# EAGLE schematic rhoby_motor(L6205) (EAGLE 8.3.0)
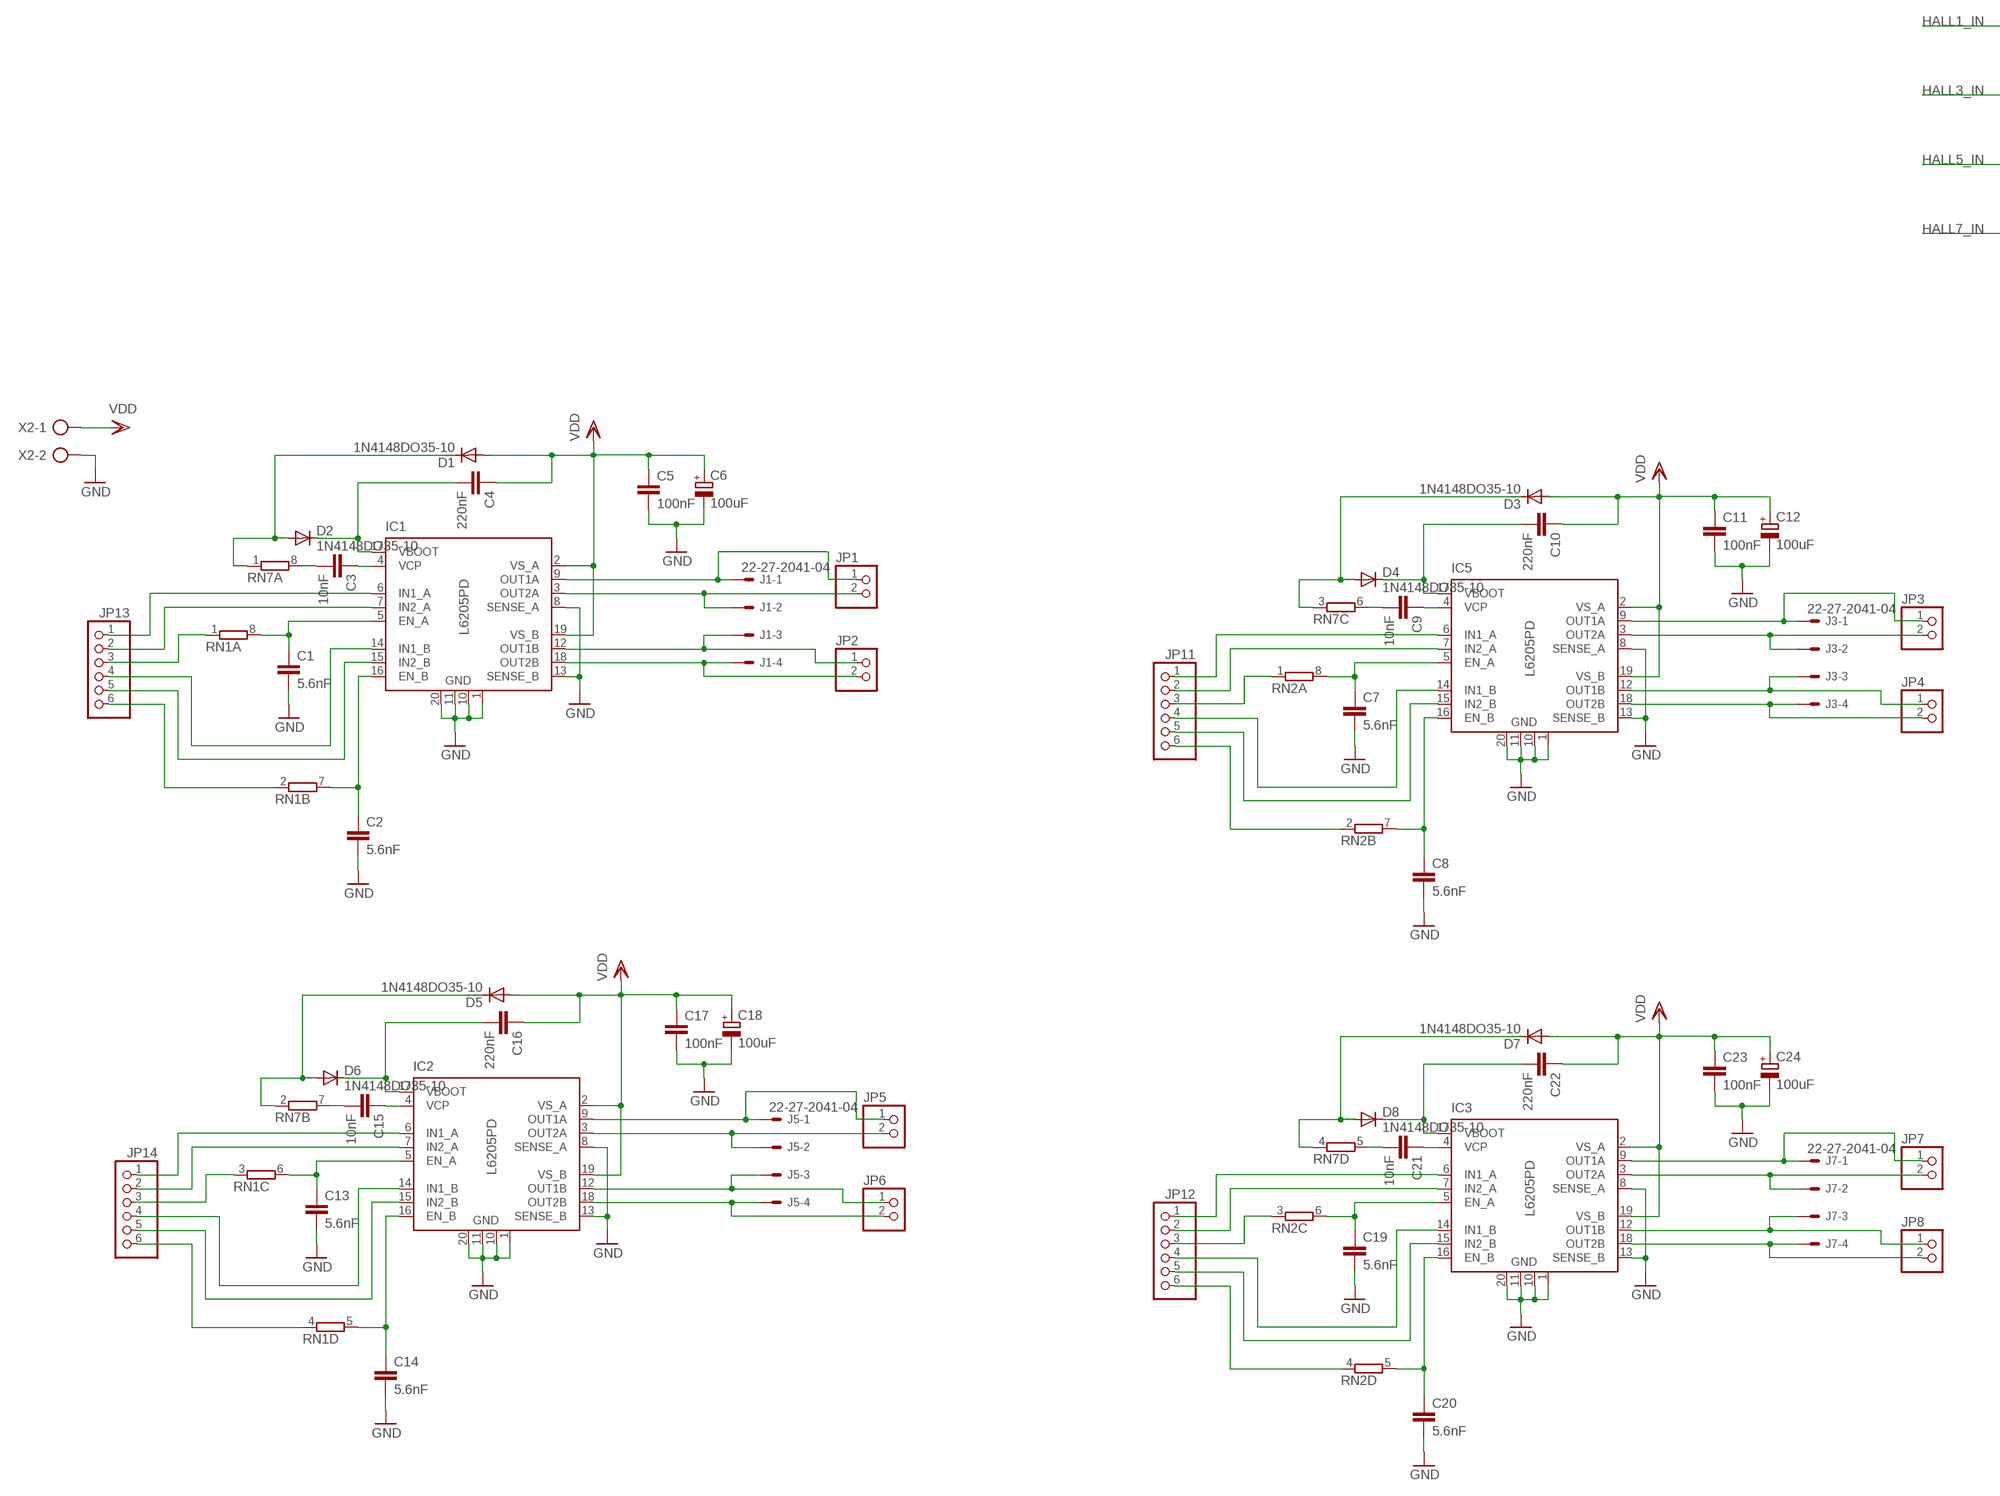
[diagram p0: schematic, sheet 1, part 1 of 2]
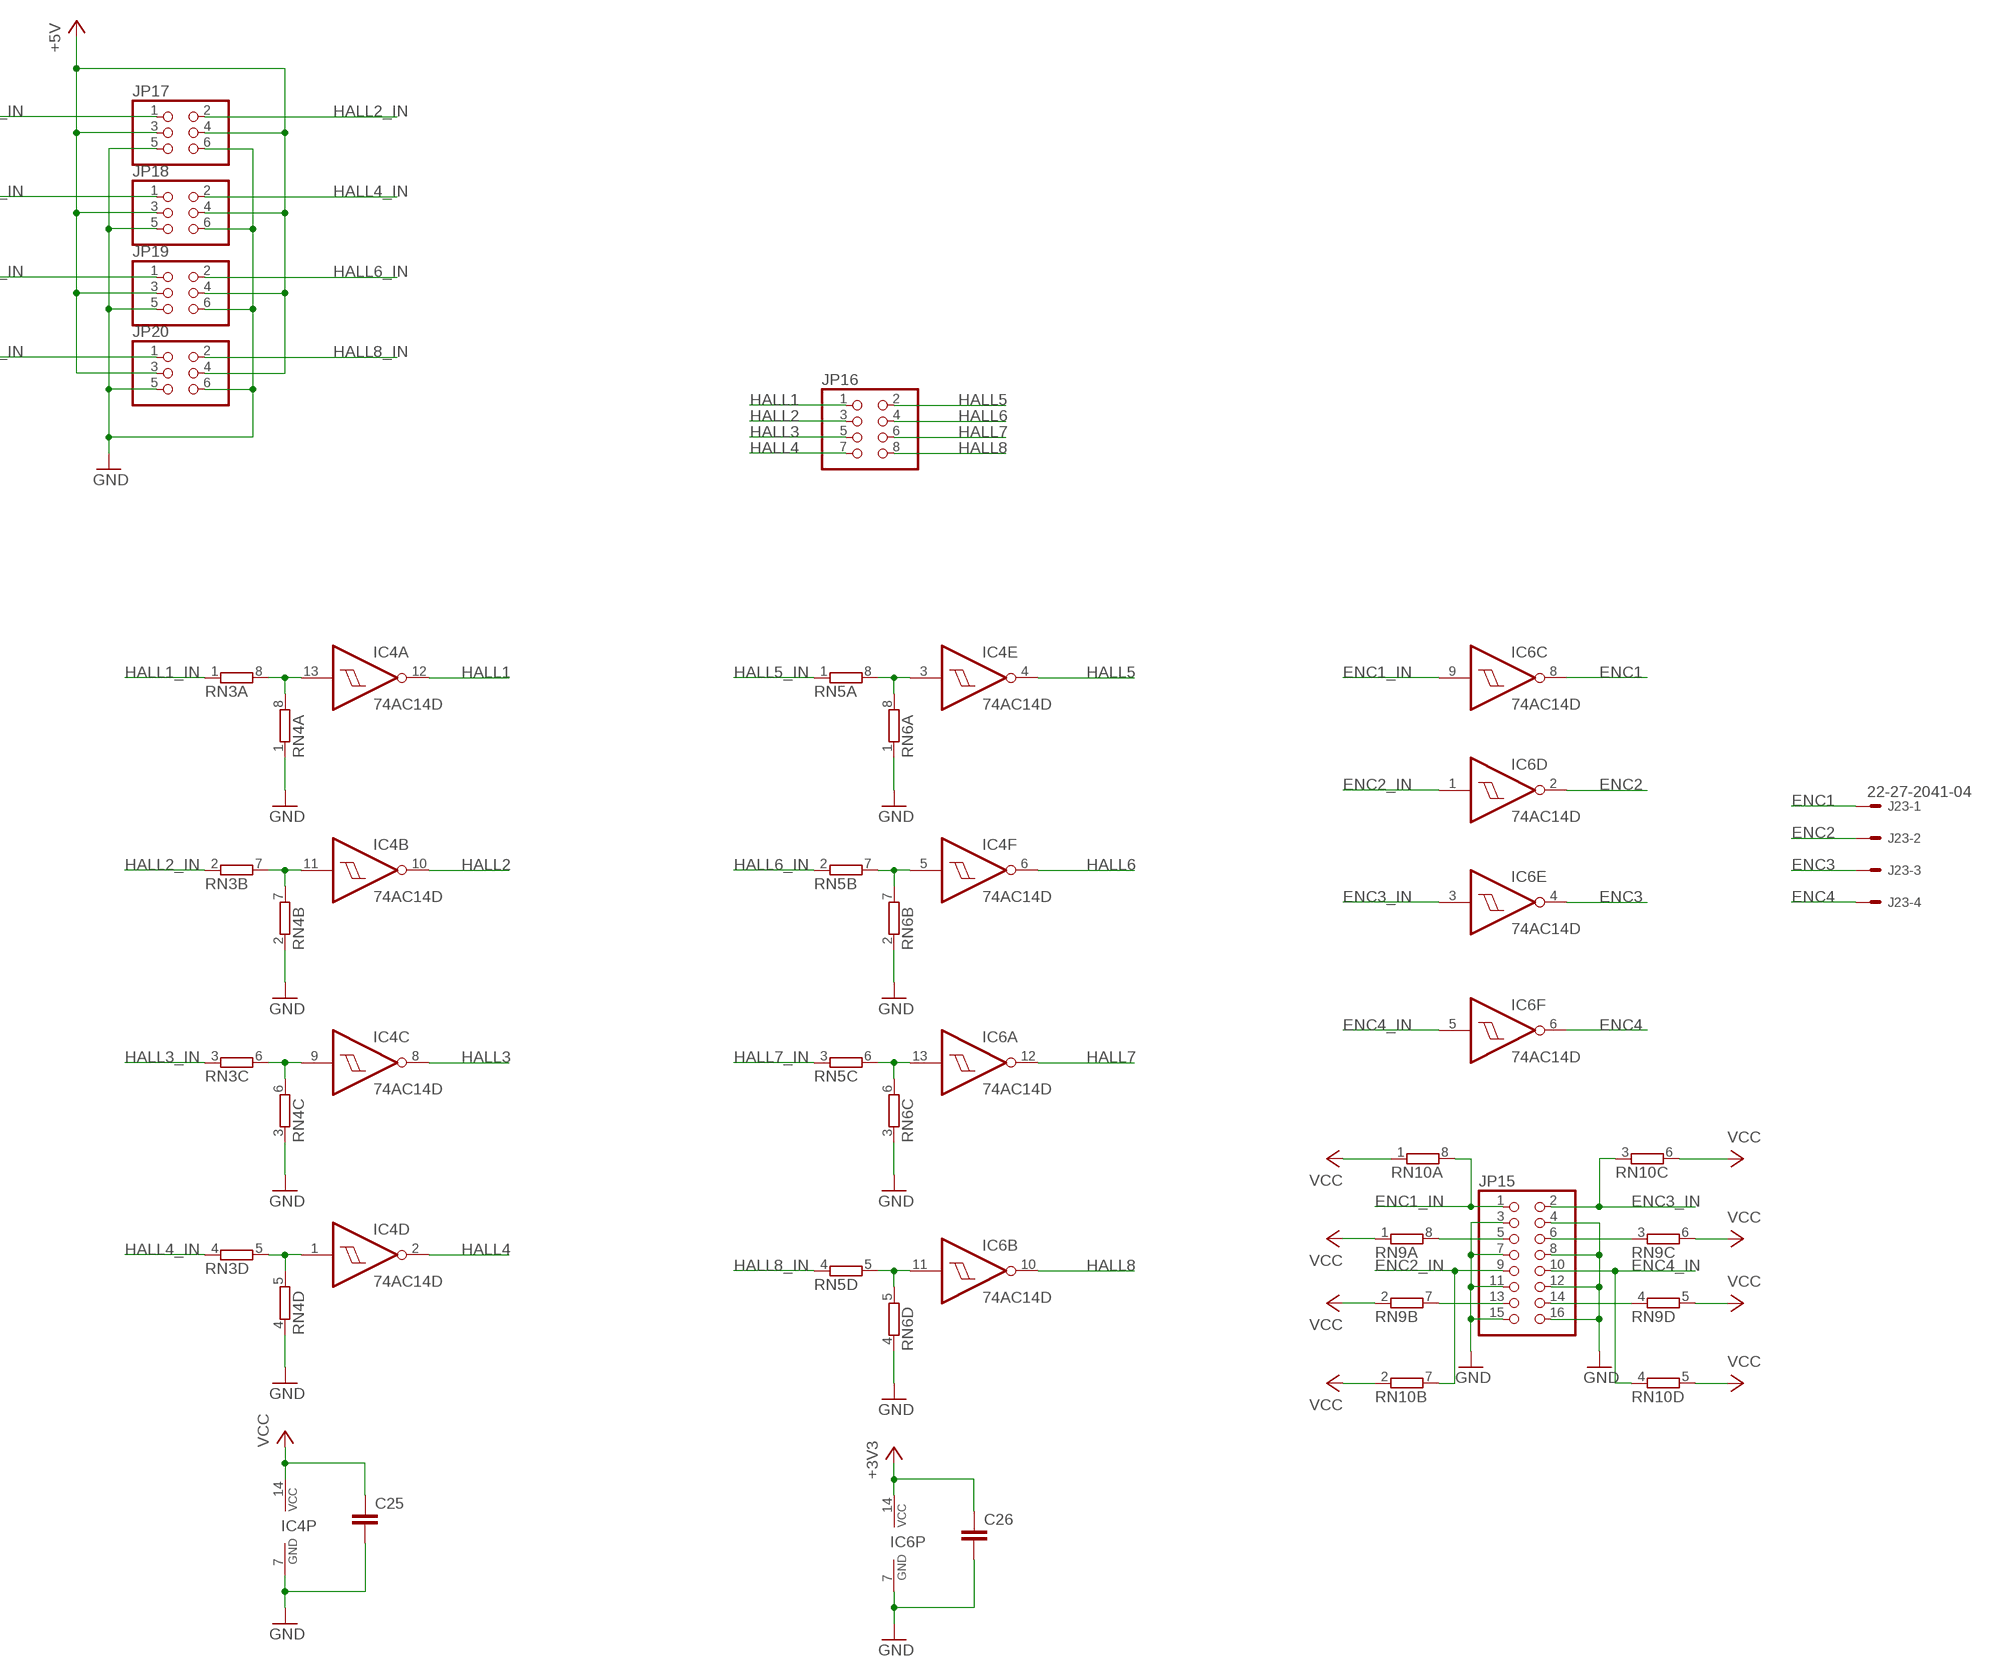
[diagram p1: schematic, sheet 1, part 2 of 2]

## Parts
C1  5.6nF  C-EUC0603K  [C0603K]
C2  5.6nF  C-EUC0603K  [C0603K]
C3  10nF  C-EUC0805K  [C0805K]
C4  220nF  C-EUC0805K  [C0805K]
C5  100nF  C-EUC2220K  [C2220K]
C6  100uF  CPOL-EUSMCD  [SMC_D]
C7  5.6nF  C-EUC0603K  [C0603K]
C8  5.6nF  C-EUC0603K  [C0603K]
C9  10nF  C-EUC0805K  [C0805K]
C10  220nF  C-EUC0805K  [C0805K]
C11  100nF  C-EUC2220K  [C2220K]
C12  100uF  CPOL-EUSMCD  [SMC_D]
C13  5.6nF  C-EUC0603K  [C0603K]
C14  5.6nF  C-EUC0603K  [C0603K]
C15  10nF  C-EUC0805K  [C0805K]
C16  220nF  C-EUC0805K  [C0805K]
C17  100nF  C-EUC2220K  [C2220K]
C18  100uF  CPOL-EUSMCD  [SMC_D]
C19  5.6nF  C-EUC0603K  [C0603K]
C20  5.6nF  C-EUC0603K  [C0603K]
C21  10nF  C-EUC0805K  [C0805K]
C22  220nF  C-EUC0805K  [C0805K]
C23  100nF  C-EUC2220K  [C2220K]
C24  100uF  CPOL-EUSMCD  [SMC_D]
C25  C-EUC0603K  [C0603K]
C26  C-EUC0603K  [C0603K]
D1  1N4148DO35-10  [DO35-10]
D2  1N4148DO35-10  [DO35-10]
D3  1N4148DO35-10  [DO35-10]
D4  1N4148DO35-10  [DO35-10]
D5  1N4148DO35-10  [DO35-10]
D6  1N4148DO35-10  [DO35-10]
D7  1N4148DO35-10  [DO35-10]
D8  1N4148DO35-10  [DO35-10]
IC1  L6205PD  [POWERSO-20]
IC2  L6205PD  [POWERSO-20]
IC3  L6205PD  [POWERSO-20]
IC4  74AC14D  [SO14]
IC5  L6205PD  [POWERSO-20]
IC6  74AC14D  [SO14]
J1  22-27-2041-04  [6410-04]
J3  22-27-2041-04  [6410-04]
J5  22-27-2041-04  [6410-04]
J7  22-27-2041-04  [6410-04]
J23  22-27-2041-04  [6410-04]
JP1  PINHD-1X2  [1X02]
JP2  PINHD-1X2  [1X02]
JP3  PINHD-1X2  [1X02]
JP4  PINHD-1X2  [1X02]
JP5  PINHD-1X2  [1X02]
JP6  PINHD-1X2  [1X02]
JP7  PINHD-1X2  [1X02]
JP8  PINHD-1X2  [1X02]
JP11  PINHD-1X6  [1X06]
JP12  PINHD-1X6  [1X06]
JP13  PINHD-1X6  [1X06]
JP14  PINHD-1X6  [1X06]
JP15  PINHD-2X8  [2X08]
JP16  PINHD-2X4  [2X04]
JP17  PINHD-2X3  [2X03]
JP18  PINHD-2X3  [2X03]
JP19  PINHD-2X3  [2X03]
JP20  PINHD-2X3  [2X03]
RN1  4R-NEXB38V  [EXB38V]
RN2  4R-NEXB38V  [EXB38V]
RN3  4R-NEXB38V  [EXB38V]
RN4  4R-NEXB38V  [EXB38V]
RN5  4R-NEXB38V  [EXB38V]
RN6  4R-NEXB38V  [EXB38V]
RN7  4R-NEXB38V  [EXB38V]
RN9  4R-NEXB38V  [EXB38V]
RN10  4R-NEXB38V  [EXB38V]
X2  AK500/2  [AK500/2]

## Nets
+3V3: C26.1 IC6.14(P:VCC)
+5V: JP17.3 JP17.4 JP18.3 JP18.4 JP19.3 JP19.4 JP20.3 JP20.4
ENC1: IC6.8(C:O) J23.1
ENC1_IN: IC6.9(C:I) JP15.1 RN10.8
ENC2: IC6.2(D:O) J23.2
ENC2_IN: IC6.1(D:I) JP15.9 RN10.7
ENC3: IC6.4(E:O) J23.3
ENC3_IN: IC6.3(E:I) JP15.2 RN10.3
ENC4: IC6.6(F:O) J23.4
ENC4_IN: IC6.5(F:I) JP15.10 RN10.4
GND: C1.2 C2.2 C5.2 C6.- C7.2 C8.2 C11.2 C12.- C13.2 C14.2 C17.2 C18.- C19.2 C20.2 C23.2 C24.- C25.2 C26.2 IC1.1(GND) IC1.8(SENSE_A) IC1.10(GND) IC1.11(GND) IC1.13(SENSE_B) IC1.20(GND) IC2.1(GND) IC2.8(SENSE_A) IC2.10(GND) IC2.11(GND) IC2.13(SENSE_B) IC2.20(GND) IC3.1(GND) IC3.8(SENSE_A) IC3.10(GND) IC3.11(GND) IC3.13(SENSE_B) IC3.20(GND) IC4.7(P:GND) IC5.1(GND) IC5.8(SENSE_A) IC5.10(GND) IC5.11(GND) IC5.13(SENSE_B) IC5.20(GND) IC6.7(P:GND) JP15.3 JP15.4 JP15.7 JP15.8 JP15.11 JP15.12 JP15.15 JP15.16 JP17.5 JP17.6 JP18.5 JP18.6 JP19.5 JP19.6 JP20.5 JP20.6 RN4.1 RN4.2 RN4.3 RN4.4 RN6.1 RN6.2 RN6.3 RN6.4 X2.2
HALL1: IC4.12(A:O) JP16.1
HALL1_IN: JP17.1 RN3.1
HALL2: IC4.10(B:O) JP16.3
HALL2_IN: JP17.2 RN3.2
HALL3: IC4.8(C:O) JP16.5
HALL3_IN: JP18.1 RN3.3
HALL4: IC4.2(D:O) JP16.7
HALL4_IN: JP18.2 RN3.4
HALL5: IC4.4(E:O) JP16.2
HALL5_IN: JP19.1 RN5.1
HALL6: IC4.6(F:O) JP16.4
HALL6_IN: JP19.2 RN5.2
HALL7: IC6.12(A:O) JP16.6
HALL7_IN: JP20.1 RN5.3
HALL8: IC6.10(B:O) JP16.8
HALL8_IN: JP20.2 RN5.4
N$1: IC1.6(IN1_A) JP13.1
N$2: IC1.7(IN2_A) JP13.2
N$3: C1.1 IC1.5(EN_A) RN1.8
N$4: IC1.14(IN1_B) JP13.4
N$5: D1.C D2.A RN7.1
N$6: C2.1 IC1.16(EN_B) RN1.7
N$7: IC1.15(IN2_B) JP13.5
N$8: C3.1 IC1.4(VCP)
N$9: IC1.9(OUT1A) J1.1 JP1.1
N$10: IC1.3(OUT2A) J1.2 JP1.2
N$11: IC1.12(OUT1B) J1.3 JP2.1
N$12: IC1.18(OUT2B) J1.4 JP2.2
N$13: C4.2 D2.C IC1.17(VBOOT)
N$14: C3.2 RN7.8
N$15: JP13.6 RN1.2
N$16: JP13.3 RN1.1
N$17: C14.1 IC2.16(EN_B) RN1.5
N$18: IC2.9(OUT1A) J5.1 JP5.1
N$19: IC2.3(OUT2A) J5.2 JP5.2
N$20: C8.1 IC5.16(EN_B) RN2.7
N$21: IC5.9(OUT1A) J3.1 JP3.1
N$22: IC5.3(OUT2A) J3.2 JP3.2
N$23: IC5.12(OUT1B) J3.3 JP4.1
N$24: IC5.18(OUT2B) J3.4 JP4.2
N$25: C10.2 D4.C IC5.17(VBOOT)
N$26: D3.C D4.A RN7.3
N$27: C9.1 IC5.4(VCP)
N$28: C9.2 RN7.6
N$29: IC5.6(IN1_A) JP11.1
N$30: IC5.7(IN2_A) JP11.2
N$31: C7.1 IC5.5(EN_A) RN2.8
N$32: IC5.14(IN1_B) JP11.4
N$33: IC5.15(IN2_B) JP11.5
N$34: JP11.6 RN2.2
N$35: JP11.3 RN2.1
N$36: IC2.12(OUT1B) J5.3 JP6.1
N$37: IC2.18(OUT2B) J5.4 JP6.2
N$38: C16.2 D6.C IC2.17(VBOOT)
N$39: D5.C D6.A RN7.2
N$40: C15.1 IC2.4(VCP)
N$41: C15.2 RN7.7
N$42: IC2.6(IN1_A) JP14.1
N$43: IC2.7(IN2_A) JP14.2
N$44: C13.1 IC2.5(EN_A) RN1.6
N$45: IC2.14(IN1_B) JP14.4
N$46: IC2.15(IN2_B) JP14.5
N$47: JP14.6 RN1.4
N$48: JP14.3 RN1.3
N$49: C20.1 IC3.16(EN_B) RN2.5
N$50: IC3.9(OUT1A) J7.1 JP7.1
N$51: IC3.3(OUT2A) J7.2 JP7.2
N$52: IC3.12(OUT1B) J7.3 JP8.1
N$53: IC3.18(OUT2B) J7.4 JP8.2
N$54: C22.2 D8.C IC3.17(VBOOT)
N$55: D7.C D8.A RN7.4
N$56: C21.1 IC3.4(VCP)
N$57: C21.2 RN7.5
N$58: IC3.6(IN1_A) JP12.1
N$59: IC3.7(IN2_A) JP12.2
N$60: C19.1 IC3.5(EN_A) RN2.6
N$61: IC3.14(IN1_B) JP12.4
N$62: IC3.15(IN2_B) JP12.5
N$63: JP12.6 RN2.4
N$64: JP12.3 RN2.3
N$65: IC4.13(A:I) RN3.8 RN4.8
N$66: IC4.11(B:I) RN3.7 RN4.7
N$67: IC4.9(C:I) RN3.6 RN4.6
N$68: IC6.13(A:I) RN5.6 RN6.6
N$69: IC4.5(F:I) RN5.7 RN6.7
N$70: IC4.1(D:I) RN3.5 RN4.5
N$71: IC6.11(B:I) RN5.5 RN6.5
N$72: IC4.3(E:I) RN5.8 RN6.8
N$77: JP15.13 RN9.7
N$78: JP15.5 RN9.8
N$79: JP15.6 RN9.3
N$80: JP15.14 RN9.4
VCC: C25.1 IC4.14(P:VCC) RN9.1 RN9.2 RN9.5 RN9.6 RN10.1 RN10.2 RN10.5 RN10.6
VDD: C4.1 C5.1 C6.+ C10.1 C11.1 C12.+ C16.1 C17.1 C18.+ C22.1 C23.1 C24.+ D1.A D3.A D5.A D7.A IC1.2(VS_A) IC1.19(VS_B) IC2.2(VS_A) IC2.19(VS_B) IC3.2(VS_A) IC3.19(VS_B) IC5.2(VS_A) IC5.19(VS_B) X2.1

## Library data of the parts
C1-C5 C7-C11 C13-C17 C19-C23 C25 C26 = rcl:C-EU: CAPACITOR, European symbol; SPICEPREFIX: C
C6 C12 C18 C24 = rcl:CPOL-EU: POLARIZED CAPACITOR, European symbol; SPICEPREFIX: C
D1-D8 = diode:1N4148: DIODE high speed (Philips)
IC1-IC3 IC5 = st-microelectronics:L6205: DUAL DMOS FULL BRIDGE MOTOR DRIVER; MF: Arrow Electronics; MPN: L6205PD; OC_FARNELL: unknown; OC_NEWARK: 89K0755
IC4 = 74xx-eu:74*14: Hex schmitt trigger INVERTER
IC6 = 74xx-eu:74*14: Hex schmitt trigger INVERTER; SPICEPREFIX: I
J1 J3 J5 J7 J23 = con-molex:22-?-04: CONNECTOR wire to board 2.54 mm (.1 inch) pitch header; MF: MOLEX; OC_FARNELL: unknown; OC_NEWARK: unknown
JP1-JP8 = pinhead:PINHD-1X2: PIN HEADER
JP11-JP14 = pinhead:PINHD-1X6: PIN HEADER
JP15 = pinhead:PINHD-2X8: PIN HEADER
JP16 = pinhead:PINHD-2X4: PIN HEADER
JP17-JP20 = pinhead:PINHD-2X3: PIN HEADER
RN1-RN7 RN9 RN10 = resistor-dil:4R-N: Array Chip Resistor Source: RS Component / Phycomp; OC_FARNELL: unknown; OC_NEWARK: unknown
X2 = con-ptr500:AK500/2: CONNECTOR; OC_FARNELL: unknown; OC_NEWARK: unknown